# EAGLE design icesio2 (EAGLE 9.3.0)
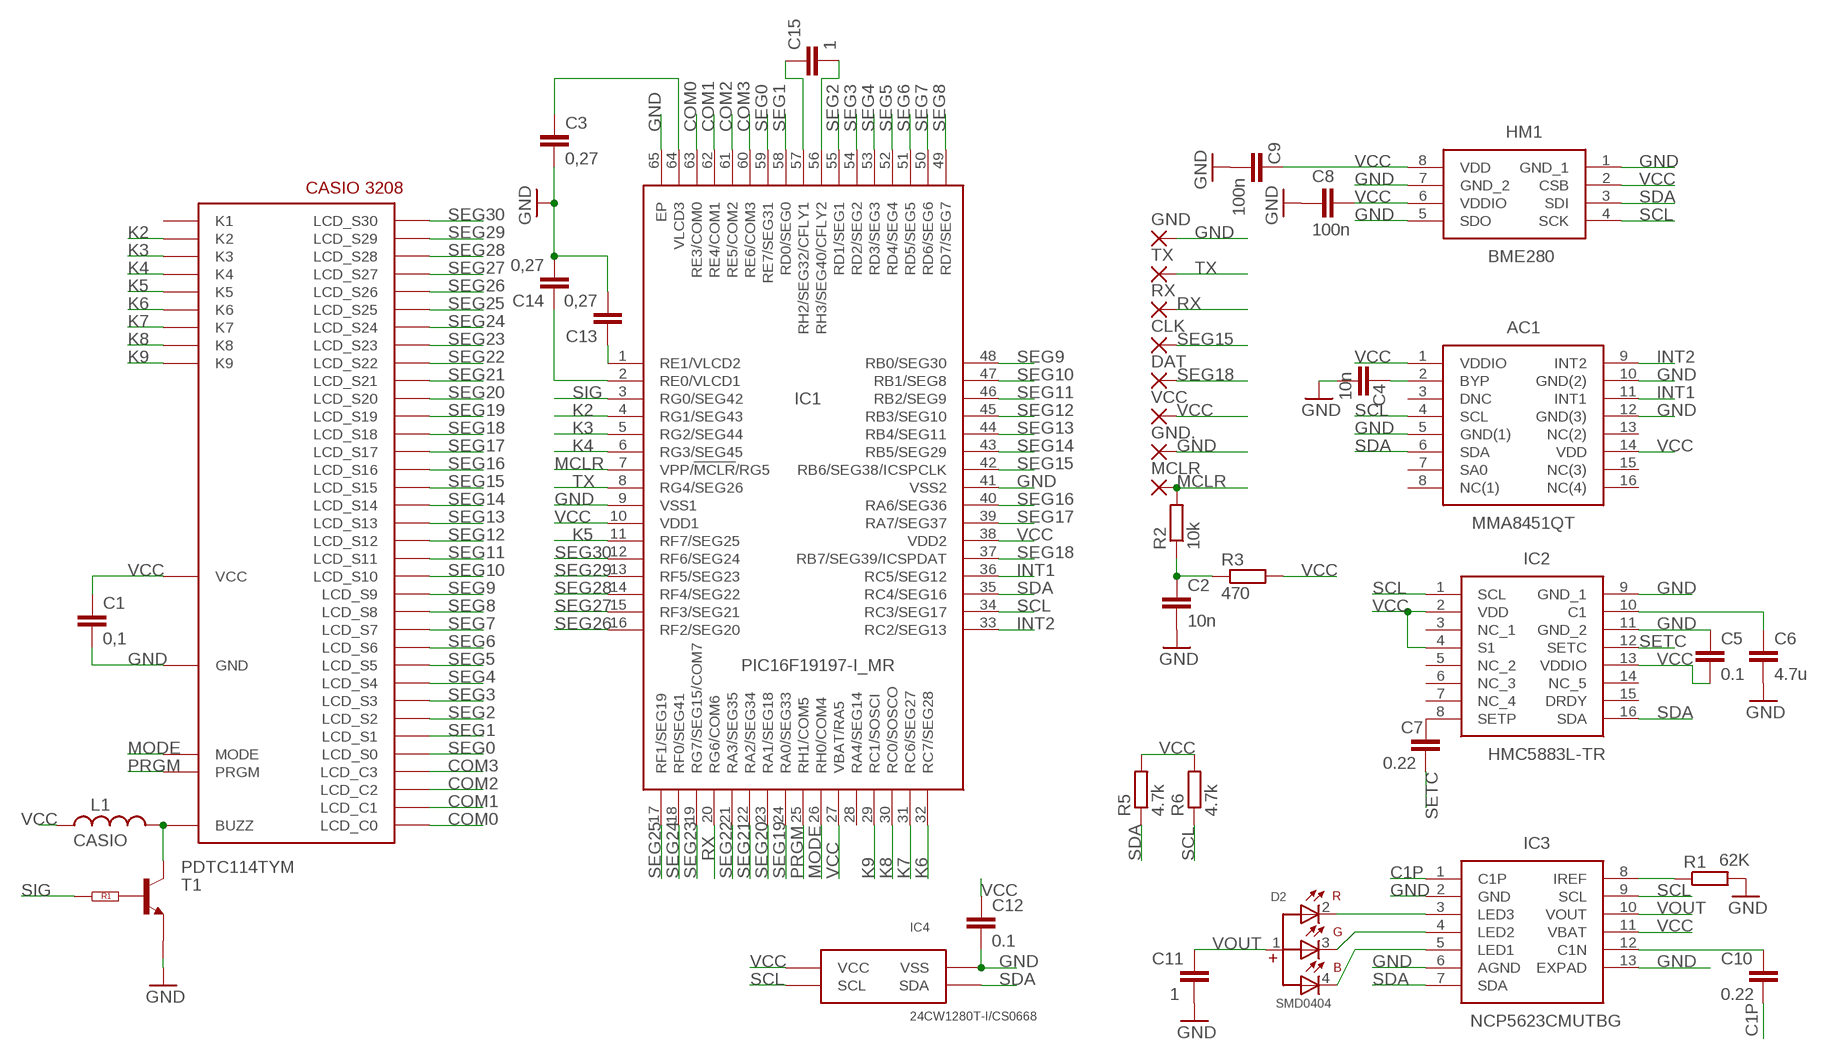
[diagram p0: schematic, sheet 1]

## Parts
AC1  MMA8451QT  [PQFN50P300X300X100-16N]
C1  0,1  CAPACITOR_0402_L  [RESC0402_L]
C2  10n  CAPACITOR_0402_L  [RESC0402_L]
C3  0,27  CAPACITOR_0402_L  [RESC0402_L]
C4  10n  CAPACITOR_0402_L  [RESC0402_L]
C5  0.1  CAPACITOR_0402_L  [RESC0402_L]
C6  4.7u  CAPACITOR_0402_L  [RESC0402_L]
C7  0.22  CAPACITOR_0402_L  [RESC0402_L]
C8  100n  CAPACITOR_0402_L  [RESC0402_L]
C9  100n  CAPACITOR_0402_L  [RESC0402_L]
C10  0.22  CAPACITOR_0402_L  [RESC0402_L]
C11  1  CAPACITOR_0402_L  [RESC0402_L]
C12  0.1  CAPACITOR_0402_L  [RESC0402_L]
C13  0,27  CAPACITOR_0402_L  [RESC0402_L]
C14  0,27  CAPACITOR_0402_L  [RESC0402_L]
C15  1  CAPACITOR_0402_L  [RESC0402_L]
CLK  WIREPADSMD1,27-254  [SMD1,27-2,54]
D2  SMD0404  WL-SFCC_0404_150044M155260  [WL-SFCC_0404]
DAT  WIREPADSMD1,27-254  [SMD1,27-2,54]
GND  WIREPADSMD1,27-254  [SMD1,27-2,54]
GND.  WIREPADSMD1,27-254  [SMD1,27-2,54]
HM1  BME280  [BME280]
IC1  PIC16F19197-I_MR  [QFN50P900X900X100-65N]
IC2  HMC5883L-TR  [16-PIN-LPCC]
IC3  NCP5623CMUTBG  [NCP5623BMUTBG]
IC4  24CW1280T-I/CS0668  [CSP]
L1  CASIO  L-USL4516C  [L4516C]
MCLR  WIREPADSMD1,27-254  [SMD1,27-2,54]
R1  62K  R-EU_R0402  [R0402]
R2  10k  R-EU_R0402  [R0402]
R3  470  R-EU_R0402  [R0402]
R5  4.7k  R-EU_R0402  [R0402]
R6  4.7k  R-EU_R0402  [R0402]
RX  WIREPADSMD1,27-254  [SMD1,27-2,54]
T1  PDTC114TYM  [SOT883(B)]
TX  WIREPADSMD1,27-254  [SMD1,27-2,54]
U$1  CASIO3208  [CASIO3208]
VCC  WIREPADSMD1,27-254  [SMD1,27-2,54]

## Nets
BUZ: L1.2 T1.3(C) U$1.BUZZ
BYP: AC1.2(BYP) C4.1
C1: C6.1 IC2.10(C1)
C1P: C10.2 IC3.1(C1P)
CFLY1: C15.1 IC1.57(RH2/SEG32/CFLY1)
CFLY2: C15.2 IC1.56(RH3/SEG40/CFLY2)
COM0: IC1.63(RE3/COM0) U$1.LCD1(LCD_C0)
COM1: IC1.62(RE4/COM1) U$1.LCD2(LCD_C1)
COM2: IC1.61(RE5/COM2) U$1.LCD3(LCD_C2)
COM3: IC1.60(RE6/COM3) U$1.LCD4(LCD_C3)
GND: AC1.5(GND(1)) AC1.10(GND(2)) AC1.12(GND(3)) C1.2 C2.2 C3.2 C4.2 C5.1 C6.2 C8.2 C9.2 C11.2 C12.2 C13.2 C14.2 GND.1(P) GND..1(P) HM1.1(GND_1) HM1.5(SDO) HM1.7(GND_2) IC1.9(VSS1) IC1.41(VSS2) IC1.65(EP) IC2.9(GND_1) IC2.11(GND_2) IC3.2(GND) IC3.6(AGND) IC3.13(EXPAD) IC4.VSS R1.2 T1.2(E) U$1.GND
INT1: AC1.11(INT1) IC1.36(RC5/SEG12)
INT2: AC1.9(INT2) IC1.33(RC2/SEG13)
K2: IC1.4(RG1/SEG43) U$1.K2
K3: IC1.5(RG2/SEG44) U$1.K3
K4: IC1.6(RG3/SEG45) U$1.K4
K5: IC1.11(RF7/SEG25) U$1.K5
K6: IC1.32(RC7/SEG28) U$1.K6
K7: IC1.31(RC6/SEG27) U$1.K7
K8: IC1.30(RC0/SOSCO) U$1.K8
K9: IC1.29(RC1/SOSCI) U$1.K9
MCLR: IC1.7(VPP/!MCLR!/RG5) MCLR.1(P) R2.2
MCLRVCC: C2.1 R2.1 R3.1
MODE: IC1.26(RH0/COM4) U$1.MODE
N$1: D2.2(R) IC3.3(LED3)
N$2: C7.1 IC2.8(SETP)
N$3: D2.3(G) IC3.4(LED2)
N$4: D2.4(B) IC3.5(LED1)
N$5: IC3.8(IREF) R1.1
N$6: C10.1 IC3.12(C1N)
PRGM: IC1.25(RH1/COM5) U$1.PRGM
RX: IC1.20(RG6/COM6) RX.1(P)
SCL: AC1.4(SCL) HM1.4(SCK) IC1.34(RC3/SEG17) IC2.1(SCL) IC3.9(SCL) IC4.SCL R6.1
SDA: AC1.6(SDA) HM1.3(SDI) IC1.35(RC4/SEG16) IC2.16(SDA) IC3.7(SDA) IC4.SDA R5.1
SEG0: IC1.59(RE7/SEG31) U$1.LCD5(LCD_S0)
SEG1: IC1.58(RD0/SEG0) U$1.LCD6(LCD_S1)
SEG2: IC1.55(RD1/SEG1) U$1.LCD7(LCD_S2)
SEG3: IC1.54(RD2/SEG2) U$1.LCD8(LCD_S3)
SEG4: IC1.53(RD3/SEG3) U$1.LCD9(LCD_S4)
SEG5: IC1.52(RD4/SEG4) U$1.LCD10(LCD_S5)
SEG6: IC1.51(RD5/SEG5) U$1.LCD11(LCD_S6)
SEG7: IC1.50(RD6/SEG6) U$1.LCD12(LCD_S7)
SEG8: IC1.49(RD7/SEG7) U$1.LCD13(LCD_S8)
SEG9: IC1.48(RB0/SEG30) U$1.LCD14(LCD_S9)
SEG10: IC1.47(RB1/SEG8) U$1.LCD15(LCD_S10)
SEG11: IC1.46(RB2/SEG9) U$1.LCD16(LCD_S11)
SEG12: IC1.45(RB3/SEG10) U$1.LCD17(LCD_S12)
SEG13: IC1.44(RB4/SEG11) U$1.LCD18(LCD_S13)
SEG14: IC1.43(RB5/SEG29) U$1.LCD19(LCD_S14)
SEG15: CLK.1(P) IC1.42(RB6/SEG38/ICSPCLK) U$1.LCD20(LCD_S15)
SEG16: IC1.40(RA6/SEG36) U$1.LCD21(LCD_S16)
SEG17: IC1.39(RA7/SEG37) U$1.LCD22(LCD_S17)
SEG18: DAT.1(P) IC1.37(RB7/SEG39/ICSPDAT) U$1.LCD23(LCD_S18)
SEG19: IC1.24(RA0/SEG33) U$1.LCD24(LCD_S19)
SEG20: IC1.23(RA1/SEG18) U$1.LCD25(LCD_S20)
SEG21: IC1.22(RA2/SEG34) U$1.LCD26(LCD_S21)
SEG22: IC1.21(RA3/SEG35) U$1.LCD27(LCD_S22)
SEG23: IC1.19(RG7/SEG15/COM7) U$1.LCD28(LCD_S23)
SEG24: IC1.18(RF0/SEG41) U$1.LCD29(LCD_S24)
SEG25: IC1.17(RF1/SEG19) U$1.LCD30(LCD_S25)
SEG26: IC1.16(RF2/SEG20) U$1.LCD31(LCD_S26)
SEG27: IC1.15(RF3/SEG21) U$1.LCD32(LCD_S27)
SEG28: IC1.14(RF4/SEG22) U$1.LCD33(LCD_S28)
SEG29: IC1.13(RF5/SEG23) U$1.LCD34(LCD_S29)
SEG30: IC1.12(RF6/SEG24) U$1.LCD35(LCD_S30)
SETC: C7.2 IC2.12(SETC)
SIG: IC1.3(RG0/SEG42) T1.1(INPUT)
TX: IC1.8(RG4/SEG26) TX.1(P)
VCC: AC1.1(VDDIO) AC1.14(VDD) C1.1 C5.2 C8.1 C9.1 C12.1 HM1.2(CSB) HM1.6(VDDIO) HM1.8(VDD) IC1.10(VDD1) IC1.27(VBAT/RA5) IC1.38(VDD2) IC2.2(VDD) IC2.4(S1) IC2.13(VDDIO) IC3.11(VBAT) IC4.VCC L1.1 R3.2 R5.2 R6.2 U$1.VCC VCC.1(P)
VLCD1: C14.1 IC1.2(RE0/VLCD1)
VLCD2: C13.1 IC1.1(RE1/VLCD2)
VLCD3: C3.1 IC1.64(VLCD3)
VOUT: C11.1 D2.1 IC3.10(VOUT)
Unconnected: AC1.3(DNC) AC1.7(SA0) AC1.8(NC(1)) AC1.13(NC(2)) AC1.15(NC(3)) AC1.16(NC(4)) IC1.28(RA4/SEG14) IC2.3(NC_1) IC2.5(NC_2) IC2.6(NC_3) IC2.7(NC_4) IC2.14(NC_5) IC2.15(DRDY) U$1.K1

## Library data of the parts
AC1 = mma8451qt:MMA8451QT: Freescale MMA8451QT 3-Axis Accelerometer IC, 1.95 ??? 3.6 V 16-pin QFN <https://componentsearchengine.com/Images/3/MMA8451QT.jpg> Source: Datasheet <http://cache.freescale.com/files/sensors/doc/data_sheet/MMA8451Q.pdf>; DESCRIPTION: Freescale MMA8451QT 3-Axis Accelerometer IC, 1.95 ??? 3.6 V 16-pin QFN; HEIGHT: 1mm; MANUFACTURER_NAME: Nexperia; MANUFACTURER_PART_NUMBER: mma8451qt; RS_PART_NUMBER: 8212220P; SUPPLIER_NAME: RS
C1-C15 = Nordic_nRF:CAPACITOR: Generic chip capacitor
CLK DAT GND GND. MCLR RX TX VCC = wirepad:WIREPAD: Wire PAD connect wire on PCB
D2 = Wurth_Elektronik_Optoelectronics_rev18g:WL-SFCC_0404: SMT Full-color Chip LED Compact Characteristics Low energy consumption Anti-reflection surface Smallest RGB package Very wide viewing angle Applications Full-color display Indoor video walls Backlighting Indicator Front panel indicator Home and smart appliances Wearable and portable devices Healthcare applications Signal control system <https://katalog.we-online.de/media/images/v2/Family_WLSFCC.jpg> Details see: https://katalog.we-online.de/en/led/WL-SFCC/ Created by yingchun,Shan 2018-11-13 2018 (C) Wurth Elektronik
HM1 = BME280:BME280: Board Mount Humidity Sensors Source: Datasheet <http://ae-bst.resource.bosch.com/media/products/dokumente/bme280/BST-BME280_DS001-11.pdf>; DESCRIPTION: Board Mount Humidity Sensors; HEIGHT: mm; MANUFACTURER_NAME: Bosch Sensortec; MANUFACTURER_PART_NUMBER: BME280; MOUSER_PART_NUMBER: 262-BME280; MOUSER_PRICE-STOCK: https://www.mouser.com/Search/Refine.aspx?Keyword=262-BME280
IC1 = PIC16F19197-I_MR:PIC16F19197-I_MR: 8-bit Microcontrollers - MCU 56KB Flash, 4KB RAM, 256KB EE, LCD, 12-bit ADC2, DAC, LP COMP, PWM, CCP, CWG, SMT, ZCD, PPS, RTCC, HLT, WWDT, PMD Source: Datasheet <http://ww1.microchip.com/downloads/en/DeviceDoc/40001873C.pdf>; ARROW_PART_NUMBER: PIC16F19197-I/MR; ARROW_PRICE/STOCK: https://www.arrow.com/en/products/pic16f19197-imr/microchip-technology; DESCRIPTION: 8-bit Microcontrollers - MCU 56KB Flash, 4KB RAM, 256KB EE, LCD, 12-bit ADC2, DAC, LP COMP, PWM, CCP, CWG, SMT, ZCD, PPS, RTCC, HLT, WWDT, PMD; HEIGHT: 1mm; MANUFACTURER_NAME: Microchip; MANUFACTURER_PART_NUMBER: PIC16F19197-I/MR
IC2 = HMC5883L-TR:HMC5883L-TR: HONEYWELL - HMC5883L-TR - IC, DIGITAL COMPASS, 3 AXIS, 16 PIN Source: Datasheet <http://www.farnell.com/datasheets/2156842.pdf>; DESCRIPTION: HONEYWELL - HMC5883L-TR - IC, DIGITAL COMPASS, 3 AXIS, 16 PIN; HEIGHT: mm; MANUFACTURER_NAME: Honeywell; MANUFACTURER_PART_NUMBER: HMC5883L-TR; MOUSER_PART_NUMBER: N/A; MOUSER_PRICE-STOCK: https://www.mouser.com/Search/Refine.aspx?Keyword=N%2FA
IC3 = NCP5623CMUTBG:NCP5623CMUTBG: ON Semiconductor NCP5623CMUTBG, LED Display Driver 3-Segments, -0.3 7 V, 12-Pin LLGA Source: Datasheet <https://www.onsemi.com/pub/Collateral/NCP5623C-D.PDF>; DESCRIPTION: ON Semiconductor NCP5623CMUTBG, LED Display Driver 3-Segments, -0.3 7 V, 12-Pin LLGA; HEIGHT: mm; MANUFACTURER_NAME: ON Semiconductor; MANUFACTURER_PART_NUMBER: NCP5623CMUTBG; MOUSER_PART_NUMBER: 863-NCP5623CMUTBG; MOUSER_PRICE-STOCK: https://www.mouser.com/Search/Refine.aspx?Keyword=863-NCP5623CMUTBG; RS_PART_NUMBER: 7922118P; RS_PRICE-STOCK: http://uk.rs-online.com/web/p/products/7922118P
IC4 = 24CWXXT-I_CS0668:24CW1280T-I/CS0668
L1 = rcl:L-US: INDUCTOR, American symbol; SPICEPREFIX: L
R1-R3 R5 R6 = rcl:R-EU_: RESISTOR, European symbol; SPICEPREFIX: R
T1 = nxp_60:PDTC114T: PDTC114T NPN Resistor-Equipped Transistor (RET) family in small Surface-Mounted Device (SMD) plastic packages. AAL Eindhoven MK
U$1 = CASIO3208:CASIO3208: CASIO watch module 3208 footprint

## Board
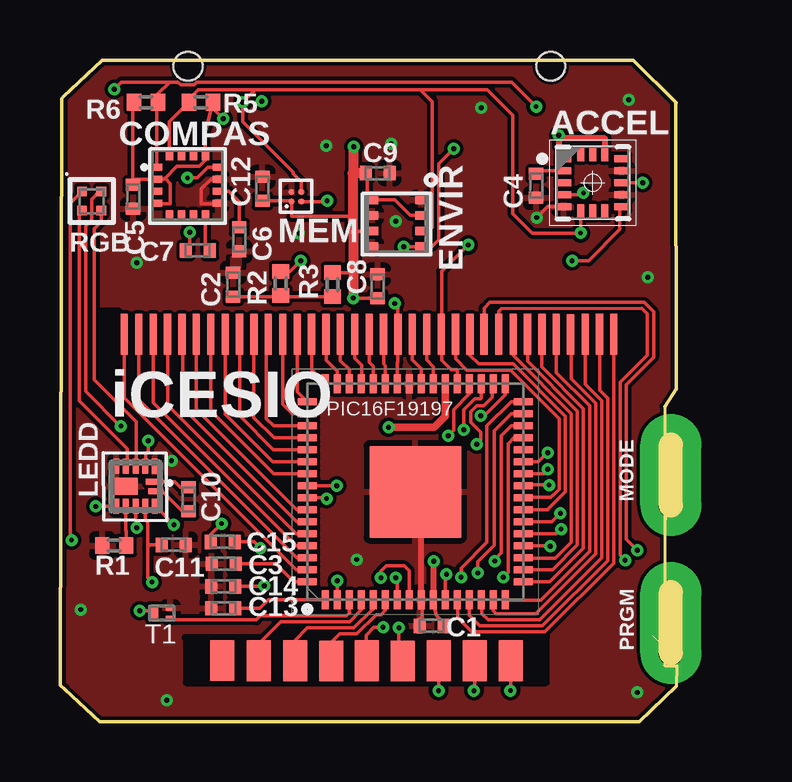
[diagram p1: board, top side]
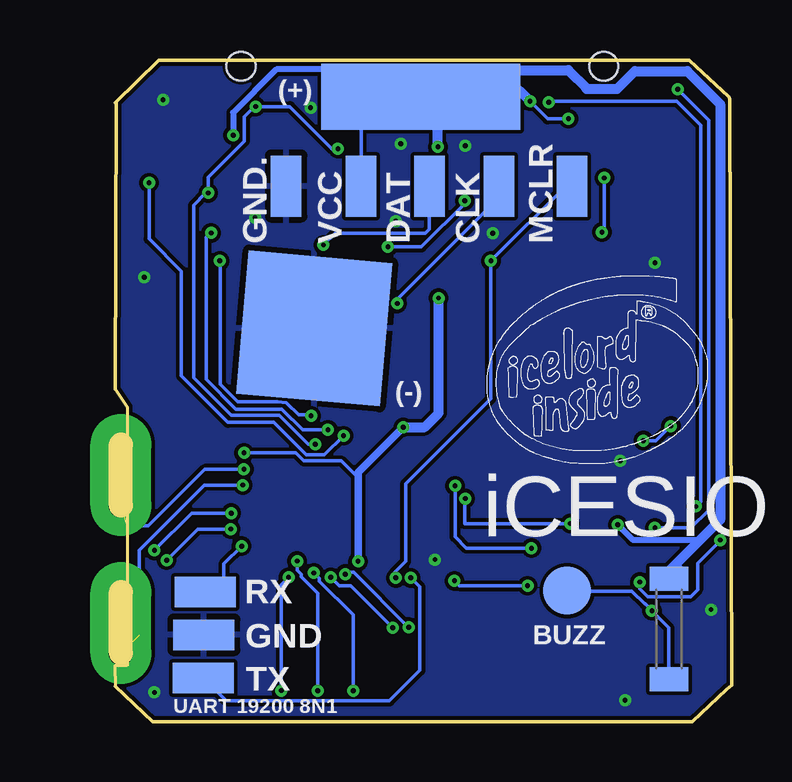
[diagram p2: board, bottom side, seen from below]

Size 25.7 x 27.57 mm. Coordinates in mm from the lower left corner, seen from the top.
Copper layers (1*16): Top 0.035mm / dielectric 1.5mm / Bottom 0.035mm
Design rules "default *": minimum track width 6mil, minimum drill 0.2mm, track to track 0.1mm, track to pad 0.1mm, pad to pad 0.1mm, via to via 0.1mm, smd to smd 0.1mm, copper to edge 0.016mm, drill to drill 6mil, minimum pad ring 0.15mm, minimum via ring 0.15mm, stop-mask expansion 0mil, vias tented up to drill 2mm, thermal gap 10mil
tRestrict: area 1.7,15.2 to 2.5,17.1; area 23.5,15.1 to 24.2,17.1; area 5.2,3.5 to 5.2,3.5; area 5.3,1.6 to 20.3,3.5

### Footprints (pad centres in the part's own frame; a part is rotated, then mirrored left to right if it is on the bottom)
PQFN50P300X300X100-16N = smd 0.6 x 0.3: 1 -1.2,1; 2 -1.2,0.5; 3 -1.2,0; 4 -1.2,-0.5; 5 -1.2,-1; 9 1.2,-1; 10 1.2,-0.5; 11 1.2,0; 12 1.2,0.5; 13 1.2,1 | smd 0.3 x 0.6: 6 -0.5,-1.2; 7 0,-1.2; 8 0.5,-1.2; 14 0.5,1.2; 15 0,1.2; 16 -0.5,1.2
RESC0402_L = smd 0.5 x 0.6: 1 -0.5,0; 2 0.5,0
SMD1,27-2,54 = smd 1.27 x 2.54: 1 0,0
WL-SFCC_0404 = smd 0.4 x 0.4: 1 -0.4,-0.4; 2 -0.4,0.4; 3 0.4,0.4; 4 0.4,-0.4
BME280 = smd 0.5 x 0.35: 1 2.05,0; 2 2.05,-0.65; 3 2.05,-1.3; 4 2.05,-1.95; 5 0,-1.95; 6 0,-1.3; 7 0,-0.65; 8 0,0
QFN50P900X900X100-65N = smd 0.8 x 0.3: 1 -4.5,3.75; 2 -4.5,3.25; 3 -4.5,2.75; 4 -4.5,2.25; 5 -4.5,1.75; 6 -4.5,1.25; 7 -4.5,0.75; 8 -4.5,0.25; 9 -4.5,-0.25; 10 -4.5,-0.75; 11 -4.5,-1.25; 12 -4.5,-1.75; 13 -4.5,-2.25; 14 -4.5,-2.75; 15 -4.5,-3.25; 16 -4.5,-3.75; 33 4.5,-3.75; 34 4.5,-3.25; 35 4.5,-2.75; 36 4.5,-2.25; 37 4.5,-1.75; 38 4.5,-1.25; 39 4.5,-0.75; 40 4.5,-0.25; 41 4.5,0.25; 42 4.5,0.75; 43 4.5,1.25; 44 4.5,1.75; 45 4.5,2.25; 46 4.5,2.75; 47 4.5,3.25; 48 4.5,3.75 | smd 0.3 x 0.8: 17 -3.75,-4.5; 18 -3.25,-4.5; 19 -2.75,-4.5; 20 -2.25,-4.5; 21 -1.75,-4.5; 22 -1.25,-4.5; 23 -0.75,-4.5; 24 -0.25,-4.5; 25 0.25,-4.5; 26 0.75,-4.5; 27 1.25,-4.5; 28 1.75,-4.5; 29 2.25,-4.5; 30 2.75,-4.5; 31 3.25,-4.5; 32 3.75,-4.5; 49 3.75,4.5; 50 3.25,4.5; 51 2.75,4.5; 52 2.25,4.5; 53 1.75,4.5; 54 1.25,4.5; 55 0.75,4.5; 56 0.25,4.5; 57 -0.25,4.5; 58 -0.75,4.5; 59 -1.25,4.5; 60 -1.75,4.5; 61 -2.25,4.5; 62 -2.75,4.5; 63 -3.25,4.5; 64 -3.75,4.5 | smd 3.81 x 3.81: 65 0,0
16-PIN-LPCC = smd 0.45 x 0.3: 1 -1.275,0.75; 2 -1.275,0.25; 3 -1.275,-0.25; 4 -1.275,-0.75; 9 1.275,-0.75; 10 1.275,-0.25; 11 1.275,0.25; 12 1.275,0.75 | smd 0.3 x 0.45: 5 -0.75,-1.275; 6 -0.25,-1.275; 7 0.25,-1.275; 8 0.75,-1.275; 13 0.75,1.275; 14 0.25,1.275; 15 -0.25,1.275; 16 -0.75,1.275
NCP5623BMUTBG = smd 0.73 x 0.25: 1 -0.785,-0.2 | smd 0.25 x 0.63: 2 -0.8,-0.835; 3 -0.4,-0.835; 4 0,-0.835; 5 0.4,-0.835; 6 0.8,-0.835; 7 0.8,0.835; 8 0.4,0.835; 9 0,0.835; 10 -0.4,0.835; 11 -0.8,0.835 | smd 0.63 x 0.25: 12 -0.835,0.2 | smd 1.06 x 0.7: 13 0.45,0
CSP = smd 0.25 x 0.25: SCL 0,-0.4; SDA 0.4,-0.4; VCC 0,0; VSS 0.4,0
L4516C = smd 1 x 1.6: 1 -2.1,0; 2 2.1,0
R0402 = smd 0.6 x 0.7: 1 -0.5,0; 2 0.5,0
SOT883(B) = smd 0.4 x 0.25: 1 -0.35,0.225; 2 -0.35,-0.225 | smd 0.4 x 0.7: 3 0.35,0
CASIO3208 = smd 2 x 2 bottom: BUZZ 6.858,5.461 | smd 6 x 6 rotated 5 bottom: GND 17.399,16.383 | smd 1 x 1.7: K1 6.77,2.55; K2 8.28,2.54; K3 9.8,2.54; K4 11.3,2.53; K5 12.78,2.54; K6 14.28,2.53; K7 15.79,2.54; K8 17.28,2.54; K9 18.78,2.54 | smd 0.3 x 1.7: LCD1 2.68,16.14; LCD2 3.28,16.14; LCD3 3.88,16.14; LCD4 4.48,16.14; LCD5 5.08,16.14; LCD6 5.68,16.14; LCD7 6.28,16.14; LCD8 6.88,16.14; LCD9 7.48,16.14; LCD10 8.08,16.14; LCD11 8.68,16.14; LCD12 9.28,16.14; LCD13 9.88,16.14; LCD14 10.48,16.14; LCD15 11.08,16.14; LCD16 11.68,16.14; LCD17 12.28,16.14; LCD18 12.88,16.14; LCD19 13.48,16.14; LCD20 14.08,16.14; LCD21 14.68,16.14; LCD22 15.28,16.14; LCD23 15.88,16.14; LCD24 16.48,16.14; LCD25 17.08,16.14; LCD26 17.67,16.14; LCD27 18.28,16.14; LCD28 18.88,16.14; LCD29 19.48,16.14; LCD30 20.08,16.14; LCD31 20.68,16.14; LCD32 21.27,16.13; LCD33 21.88,16.14; LCD34 22.48,16.14; LCD35 23.07,16.14 | drill 1 pad 2.54 offset: MODE 25.451,9.017; PRGM 25.451,2.845 | smd 8.3 x 2.75 bottom: VCC 12.954,26.035 | hole 1.2: 5.334,27.305; 20.447,27.305

### Placement (x,y rotation side)
AC1  22.2,22.45 0 top
C1  15.49,3.99 180 top
C2  7.21,18.21 90 top
C3  6.81,6.58 180 top
C4  19.84,22.33 270 top
C5  3.05,21.87 90 top
C6  7.47,20.09 270 top
C7  5.74,19.63 180 top
C8  13.23,18.14 90 top
C9  13.23,22.86 0 top
C10  5.36,9.27 90 top
C11  4.75,7.37 0 top
C12  8.43,22.2 90 top
C13  6.81,4.72 180 top
C14  6.81,5.64 180 top
C15  6.78,7.49 0 top
CLK  9.7,22.32 0 bottom
D2  1.32,21.69 270 top
DAT  12.6,22.32 0 bottom
GND  22,3.62 90 bottom
GND.  18.57,22.32 0 bottom
HM1  13,21.74 0 top
IC1  14.81,9.58 90 top
IC2  5.31,22.35 0 top
IC3  3.15,9.8 180 top
IC4  9.65,21.67 90 top
L1  2.62,3.86 270 bottom
MCLR  6.65,22.32 0 bottom
R1  2.26,7.34 180 top
R2  9.19,18.26 90 top
R3  11.35,18.21 90 top
R5  5.87,25.81 0 top
R6  3.58,25.81 180 top
RX  21.95,5.41 90 bottom
T1  4.24,4.52 180 top
TX  22.02,1.83 90 bottom
U$1  0,0 0 top
U$2  [ICELORD_SMALL]  10.59,10.36 0 bottom
VCC  15.44,22.32 0 bottom

### Tracks (layer width: path | path; a pad name or v marks a point on that pad's centre or on a via)
BUZ  (via drill 0.2)
  Top 0.152: T1.3 3.79,4.62 v3.33,4.62
  Bottom 0.152: U$1.BUZZ 6.86,5.44 4.17,5.44 3.64,4.9 3.61,4.9 v3.33,4.62 2.62,3.91 L1.2
BYP
  Top 0.152: C4.1 19.97,22.95 AC1.2
C1
  Top 0.152: IC2.10 7.02,22.1 7.47,21.66 C6.1
C1P
  Top 0.152: C10.2 5,9.77 4.77,10 IC3.1 | IC3.1
CFLY1  (via drill 0.2)
  Top 0.152: v6.73,8.26 6.28,7.81 C15.1 | v11.11,9.3 11.08,9.33 IC1.57
  Bottom 0.152: v6.73,8.26 11.13,8.26 11.13,9.27 v11.11,9.3
CFLY2  (via drill 0.2)
  Top 0.152: C15.2 8.08,7.49 v8.35,7.23 | v11.53,9.83 IC1.56
  Bottom 0.152: v8.35,7.23 11.06,7.23 11.53,7.7 v11.53,9.83
COM0
  Top 0.152: IC1.63 9.85,6.33 2.68,13.5 U$1.LCD1
COM1
  Top 0.152: IC1.62 9.86,6.83 3.28,13.41 U$1.LCD2
COM2
  Top 0.152: IC1.61 9.85,7.33 3.89,13.28 U$1.LCD3
COM3
  Top 0.152: U$1.LCD4 4.5,16.12 4.5,13.18 9.85,7.83 IC1.60
GND  (via drill 0.2)
  Top 0.152: C1.2 14.99,4.29 15.08,4.38 15.08,5.05 IC1.9 | AC1.5 20.31,21.45 v19.86,21.01 | IC2.11 6.29,22.6 5.89,22.2 5.89,21.59 IC2.9
  Top 0.254: IC1.65 15.06,9.33 IC1.9
  other vias: 4.45,0.89 23.7,25.91 14,20.85 13.79,24.08 11.1,24 17.55,25.58 4.65,10.87 9.96,20.35 12.37,6.76 0.86,4.67 24.05,1.22 24.49,18.52 3.2,19.13
  pour Bottom (isolate 0.154): 1.15,27.81 24.26,27.81 26.21,25.86 26.09,0.79 24.43,-0.3 0.75,-0.3 -0.3,0.85 -0.46,26.57 -0.31,26.77
  pour Top (isolate 0.15): -0.38,26.64 0.74,27.76 24.1,27.76 26.11,25.76 26.11,0.84 24.99,-0.28 0.99,-0.28 -0.38,1.09
INT1  (via drill 0.2)
  Top 0.152: IC1.36 17.06,13.66 16.4,13 16.4,12.14 v16.18,11.91 | AC1.11 v24.28,22.45
  Bottom 0.152: v16.18,11.91 16.97,11.12 17.72,11.12 17.75,11.14 19.07,12.47 21,12.47 22.94,14.41 22.94,18.77 24.28,20.12 v24.28,22.45
INT2  (via drill 0.2)
  Top 0.152: IC1.33 18.56,13.62 17.68,12.75 v17.53,12.75 | AC1.9 23.33,21.39 23.33,20.51 22.02,19.2 v21.34,19.2
  Bottom 0.152: v17.53,12.75 17.58,12.79 18.05,12.79 18.55,13.3 18.94,13.33 20.58,13.33 21.31,14.06 21.31,19.18 v21.34,19.2
K2
  Top 0.152: IC1.4 12.56,4.66 12.07,4.16 9.19,4.16 8.28,3.25 U$1.K2
K3
  Top 0.152: IC1.5 13.06,4.7 13.02,4.67 13,4.67 12.25,3.91 10.31,3.91 9.8,3.4 U$1.K3
K4
  Top 0.152: IC1.6 13.56,4.64 13.38,4.46 13.18,4.46 12.38,3.66 11.66,3.66 11.3,3.3 U$1.K4
K5  (via drill 0.2)
  Top 0.152: IC1.11 16.06,6.1 v16.1,6.15 | v13.46,3.94 13.08,3.94 12.75,3.61 12.75,2.57 U$1.K5
  Bottom 0.152: v16.1,6.15 16.03,6.22 15.75,6.22 13.47,3.94 v13.46,3.94
K6  (via drill 0.2)
  Top 0.152: IC1.32 18.8,13.33 18.8,13.34 17.79,12.32 17.79,7.47 16.71,6.4 v16.71,6.02 | v14.12,3.91 14.12,2.69 U$1.K6
  Bottom 0.152: v16.71,6.02 16.36,5.66 15.88,5.66 v14.12,3.91
K7  (via drill 0.2)
  Top 0.152: IC1.31 18.8,12.83 18.09,12.12 18.09,7.34 17.41,6.66 v17.41,6.2 | v15.77,1.29 15.79,1.31 U$1.K7
  Bottom 0.152: v17.41,6.2 17.18,5.97 17.18,5.86 15.77,4.45 v15.77,1.29
K8  (via drill 0.2)
  Top 0.152: IC1.30 18.8,12.33 18.39,11.91 18.39,7.04 18.11,6.76 v18.11,6.69 | v17.25,1.29 17.28,1.32 U$1.K8
  Bottom 0.152: v18.11,6.69 18.11,6.31 17.93,6.13 17.93,6.04 17.25,5.36 v17.25,1.29
K9  (via drill 0.2)
  Top 0.152: IC1.29 18.91,11.83 18.67,11.58 18.67,6.22 v18.47,6.02 | v18.77,1.29 v18.78,1.31 U$1.K9
  Bottom 0.152: v18.47,6.02 18.77,5.71 v18.77,1.29
MCLR  (via drill 0.2)
  Top 0.152: IC1.7 14.06,5.93 v14,5.99 | v10.03,19.2 9.59,18.76 R2.2
  Bottom 0.152: v14,5.99 14.05,6.04 14.05,6.22 13.59,6.68 13.59,9.91 10.03,13.46 v10.03,19.2 6.92,22.32 MCLR.1
MCLRVCC
  Top 0.152: C2.1 9.14,17.71 R2.1 9.25,17.71 R3.1
MODE  (via drill 0.2)  (1 unrouted)
  Top 0.152: IC1.26 20.16,10.32 20.33,10.49 v20.33,10.52
  Bottom 0.152: 25.19,8.16 24.31,8.16 21.95,10.52 v20.33,10.52
N$1  (via drill 0.2)
  Top 0.152: D2.2 1.64,22.09 1.32,21.77 1.32,20.9 1.07,20.65 1.07,17.36 1.07,17.35 1.07,13.76 2.52,12.32 v2.54,12.32 | v3.68,11.71 3.68,11.27 3.57,11.15 3.57,10.66 IC3.3
  Bottom 0.152: v2.54,12.32 2.56,12.32 3.18,11.71 v3.68,11.71
N$2
  Top 0.152: IC2.8 6.06,19.65 C7.1
N$3
  Top 0.152: D2.3 1.72,20.83 1.42,20.54 1.42,14.25 3.18,12.5 3.18,10.67 IC3.4
N$4
  Top 0.152: D2.4 0.79,21.16 0.79,13.38 2.79,11.38 2.79,10.68 IC3.5
N$5
  Top 0.152: IC3.8 2.75,7.96 2.76,7.95 R1.1
N$6
  Top 0.152: IC3.12 4.26,9.6 5.1,8.77 C10.1
PRGM  (via drill 0.2)  (1 unrouted)
  Top 0.152: IC1.25 19.36,9.88 20.36,9.88 v20.38,9.86
  Bottom 0.152: v20.38,9.86 21.98,9.86 24.69,7.15 24.69,3.61
RX  (via drill 0.2)
  Top 0.152: IC1.20 v20.41,7.33 v20.42,7.32
  Bottom 0.152: v20.42,7.32 21.16,6.58 21.16,5.71 21.46,5.41 RX.1
SCL  (via drill 0.2)
  Top 0.152: v21.81,22.03 21.74,21.95 AC1.4 | v19.84,25.63 18.82,26.64 5.7,26.64 5.6,26.54 5.02,26.54 4.91,26.64 4.57,26.64 | v16.41,23.88 15.77,23.24 15.77,20.08 15.48,19.79 HM1.4 v14.33,19.79 | v2.25,26.34 2.56,26.64 4.57,26.64 | IC3.9 3.15,8.13 v3.2,8.08 | v11.12,21.71 11.09,21.67 IC4.SCL | IC1.34 18.01,14.03 18.01,13.51 17.67,13.17 17.36,13.17 17.11,12.92 17.11,12.49 17.53,12.07 17.53,11.73 v17.36,11.56 | IC2.1 4.03,25.76 R6.1 4.08,26.15 4.57,26.64
  Bottom 0.152: v16.41,23.88 16.64,23.85 18.41,25.63 v19.84,25.63 19.89,25.63 20.31,25.21 20.31,24.19 21.81,22.69 v21.81,22.03 21.91,22.03 22.43,21.51 22.43,14.34 20.87,12.77 18.85,12.77 17.64,11.56 v17.36,11.56 | v2.25,26.34 0.96,25.05 0.96,8.81 1.7,8.08 v3.2,8.08 | v14.33,19.79 12.93,19.79 11.07,21.65 v11.12,21.71
SDA  (via drill 0.2)
  Top 0.152: v21.69,20.36 arc90 v21.7,20.37 | v21.7,20.37 21.7,20.46 AC1.6 | v21.7,20.37 v21.7,20.35 19.68,20.35 18.87,21.16 18.87,25.27 17.8,26.34 15.01,26.34 | IC2.16 4.56,25 R5.1 5.37,25.94 5.77,26.34 8.05,26.34 | 8.05,26.34 15.01,26.34 | 15.01,26.34 15.51,25.84 15.51,20.59 15.36,20.44 HM1.3 | 8.05,26.34 8.05,26.24 v7.62,25.81 7.62,24.99 9.73,22.89 9.73,22.82 10.05,22.5 IC4.SDA | IC3.7 v1.5,8.97 v1.49,8.97 | IC1.35 17.56,13.47 17.54,13.45 17.28,13.45 16.82,13 v16.82,12.16
  Bottom 0.152: v7.62,25.81 7.57,25.86 2.29,25.86 1.29,24.86 1.29,9.17 v1.49,8.97 | v16.82,12.16 17.88,12.16 18.74,13.03 20.66,13.03 21.89,14.26 21.89,20.18 21.72,20.36 v21.69,20.36
SEG0
  Top 0.152: U$1.LCD5 5.11,16.12 5.11,13.08 9.86,8.33 IC1.59
SEG1
  Top 0.152: U$1.LCD6 5.68,13.01 9.87,8.83 IC1.58
SEG2
  Top 0.152: U$1.LCD7 6.28,12.95 8.9,10.33 IC1.55
SEG3
  Top 0.152: U$1.LCD8 6.88,12.8 8.86,10.83 IC1.54
SEG4
  Top 0.152: U$1.LCD9 7.48,12.74 8.89,11.33 IC1.53
SEG5
  Top 0.152: U$1.LCD10 8.08,12.67 8.93,11.83 IC1.52
SEG6
  Top 0.152: U$1.LCD11 8.6,16.06 8.6,12.63 8.91,12.33 IC1.51
SEG7
  Top 0.152: IC1.50 9.68,12.83 9.28,13.22 U$1.LCD12
SEG8
  Top 0.152: U$1.LCD13 9.8,16.06 9.88,15.99 9.88,15.9 9.88,14.99 9.88,13.75 IC1.49
SEG9
  Top 0.152: IC1.48 10.48,14.65 U$1.LCD14
SEG10
  Top 0.152: U$1.LCD15 11.1,16.12 11.1,15.06 11.56,14.6 IC1.47
SEG11
  Top 0.152: IC1.46 12.06,14.65 12.07,14.66 11.68,15.04 U$1.LCD16
SEG12
  Top 0.152: U$1.LCD17 12.28,15.14 12.57,14.84 12.57,14.09 IC1.45
SEG13
  Top 0.152: IC1.44 13.06,14.81 12.88,14.98 U$1.LCD18
SEG14
  Top 0.152: U$1.LCD19 13.48,14.91 13.56,14.84 IC1.43
SEG15  (via drill 0.2)
  Top 0.152: IC1.42 14.06,14.96 14.08,14.98 U$1.LCD20 14.08,17.29 v13.95,17.42
  Bottom 0.152: CLK.1 9.7,21.84 13.95,17.59 v13.95,17.42
SEG16
  Top 0.152: IC1.40 15.06,14.63 15.06,14.71 14.68,15.09 U$1.LCD21
SEG17
  Top 0.152: U$1.LCD22 15.28,15.07 15.56,14.8 IC1.39
SEG18  (via drill 0.2)
  Top 0.152: 15.9,16.12 U$1.LCD23 | IC1.37 16.56,14.66 16.31,14.66 15.9,15.06 15.9,16.12 | v17.01,19.86 v17,19.86 15.9,18.76 15.9,16.12
  Bottom 0.152: v17.01,19.86 16.53,20.34 12.77,20.34 12.6,20.51 DAT.1
SEG19
  Top 0.152: U$1.LCD24 16.48,15.12 16.95,14.65 18.78,14.65 20.8,12.63 20.8,9.68 20.55,9.43 20.53,9.43 20.45,9.35 19.33,9.35 IC1.24
SEG20
  Top 0.152: U$1.LCD25 17.08,15.27 17.45,14.9 18.89,14.9 21.05,12.74 21.05,9.58 20.32,8.84 19.32,8.84 IC1.23
SEG21  (via drill 0.2)
  Top 0.152: v20.85,8.69 20.49,8.33 IC1.22 | U$1.LCD26 17.67,17.23 17.91,17.47 24.34,17.47 24.74,17.08 24.74,15.18 23.6,14.04 23.6,7.6 v24.05,7.14 | v24.05,7.14
  Bottom 0.152: v24.05,7.14 22.5,8.69 v20.85,8.69
SEG22  (via drill 0.2)
  Top 0.152: IC1.21 20.68,7.83 v20.88,8.03 | v23.55,6.73 23.34,6.93 23.34,14.14 24.46,15.26 24.46,17 24.24,17.22 18.39,17.21 18.28,17.1 U$1.LCD27
  Bottom 0.152: v20.88,8.03 22.25,8.03 v23.55,6.73
SEG23
  Top 0.152: IC1.19 19.33,6.81 20.64,6.81 21.31,7.47 21.31,12.84 18.88,15.27 U$1.LCD28
SEG24
  Top 0.152: U$1.LCD29 19.48,15.02 21.56,12.94 21.56,7.37 20.52,6.33 IC1.18
SEG25
  Top 0.152: U$1.LCD30 20.08,14.78 21.81,13.05 21.81,7.23 20.41,5.83 IC1.17
SEG26
  Top 0.152: U$1.LCD31 20.68,14.54 22.07,13.15 22.07,7.1 20.03,5.07 18.57,5.07 IC1.16
SEG27
  Top 0.152: U$1.LCD32 21.3,16.11 21.3,14.28 22.32,13.26 22.32,7 19.82,4.5 18.18,4.5 18.05,4.63 IC1.15
SEG28
  Top 0.152: U$1.LCD33 21.88,14.05 22.57,13.36 22.57,6.82 20,4.25 17.83,4.25 17.58,4.5 17.58,5.05 IC1.14
SEG29
  Top 0.152: U$1.LCD34 22.48,13.81 22.82,13.47 22.82,6.72 20.1,3.99 17.48,3.99 17.05,4.43 IC1.13
SEG30
  Top 0.152: U$1.LCD35 23.07,13.58 23.07,13.57 23.07,6.61 20.21,3.74 17.16,3.74 16.58,4.32 16.58,5.05 IC1.12
SETC  (via drill 0.2)
  Top 0.152: IC2.12 6.16,23.1 5.71,22.66 v5.31,22.66 | C7.2 5.41,19.63 v5.41,20.4
  Bottom 0.152: v5.31,22.66 5.31,20.5 v5.41,20.4
SIG
  Top 0.152: IC1.3 12.06,4.55 12.07,4.55 11.93,4.41 8.35,4.41 8.18,4.24 4.65,4.24 T1.1
TX  (via drill 0.2)
  Top 0.152: v13.38,5.99 13.38,6.28 13.6,6.5 14.35,6.5 14.55,6.29 14.55,5.09 IC1.8
  Bottom 0.152: v13.38,5.99 12.99,5.61 12.99,2.13 14.26,0.86 21.06,0.86 TX.1
VCC  (via drill 0.2)
  Top 0.152: IC1.10 15.53,5.05 15.68,4.43 15.99,4.12 C1.1 | 4.38,22.64 4.87,23.14 5.8,23.14 6.06,23.4 IC2.13 6.06,24.53 R5.2 6.37,25.56 v6.81,25.12 | IC2.4 4.06,21.58 4.6,21.58 4.6,22.42 4.38,22.64 | 4.38,22.64 4.36,22.65 4.31,22.6 IC2.2 3.16,22.6 C5.2 3.02,22.39 3.02,25.51 R6.2 | HM1.2 14.6,21.09 13.95,21.74 HM1.8 12.8,21.95 12.8,22.79 C9.1 | IC3.11 3.98,8.97 v4.75,8.2 | R3.2 12.15,18.71 12.22,18.64 v12.22,17.65 v12.23,17.64 C8.1 | C12.1 9.62,21.7 IC4.VCC 9.65,21.06 12.14,21.06 12.19,21.01 | IC1.27 19.93,10.83 v20.31,11.2 v20.32,11.2 | HM1.6 12.22,20.44 12.21,20.44 12.19,20.42
  Top 0.254: AC1.1 21,23.76 20.78,23.98 v20.78,24.43 20.9,24.31 22.7,24.31 AC1.14 | v15.57,6.68 15.56,6.67 IC1.10
  Top 0.305: v13.69,12.27 15.6,12.27 16.06,12.73 IC1.38
  Top 0.406: 12.24,22.86 v12.24,23.95 | 12.19,20.42 12.19,21.01 12.19,22.84 12.22,22.86 12.24,22.86 | 12.22,20.44 v12.22,17.65 | C9.1 12.24,22.86
  Bottom 0.152: VCC.1 15.44,24.99 14.4,26.04 13.11,26.04 | v6.81,25.12 7.67,25.12 v8.41,25.86 | 15.57,10.16 16.28,10.87 17.83,10.87 18.16,11.2 v20.32,11.2
  Bottom 0.254: 8.87,27.15 9.28,26.73 9.98,26.04 12.24,26.04 U$1.VCC 13.11,26.04 15.85,26.04 16.99,27.18 18.97,27.18 20.78,25.38 v20.78,24.43 | v4.75,8.2 4.14,7.6 4.14,7.59 1.3,7.59 | 2.55,6.34 2.19,6.34
  Bottom 0.305: v13.69,12.27 15.57,10.39 15.57,10.16 v15.57,6.68
  Bottom 0.406: 8.87,27.15 6.81,27.15 6.04,26.39 6.04,26.37 4.78,26.37 4.04,27.1 1.85,27.1 0.48,25.73 0.48,8.41 1.3,7.59 2.55,6.34 | v13.69,12.27 12.8,12.27 12.22,12.85 v12.22,17.65 | L1.1 2.57,5.96 2.19,6.34 | v12.24,23.95 12.24,26.04 | v8.41,25.86 9.28,26.73
VLCD1  (via drill 0.2)
  Top 0.152: v8.51,5.66 8.48,5.64 C14.1 | v11.56,5.87 IC1.2
  Bottom 0.152: v11.56,5.87 11.35,5.66 v8.51,5.66
VLCD2
  Top 0.152: IC1.1 8.67,5.08 8.32,4.72 C13.1
VLCD3
  Top 0.152: IC1.64 9.74,5.83 8.99,6.58 C3.1
VOUT  (via drill 0.2)
  Top 0.152: D2.1 0.43,21.6 0.43,7.62 v0.48,7.57 | IC3.10 3.56,8.43 3.65,8.34 3.65,7.26 | 3.65,7.26 3.65,6 v3.84,5.82 | C11.1 3.75,7.37 3.65,7.26
  Bottom 0.152: v0.48,7.57 0.48,7.54 1.42,6.6 1.42,5.5 1.72,5.21 3.51,5.21 3.84,5.54 v3.84,5.82

### Text on the board
tNames: ACCEL | COMPAS | RGB | MEM | ENVIR | iCESIO | PIC16F19197 | LEDD
bNames: (+) | (-) | iCESIO | BUZZ | UART 19200 8N1